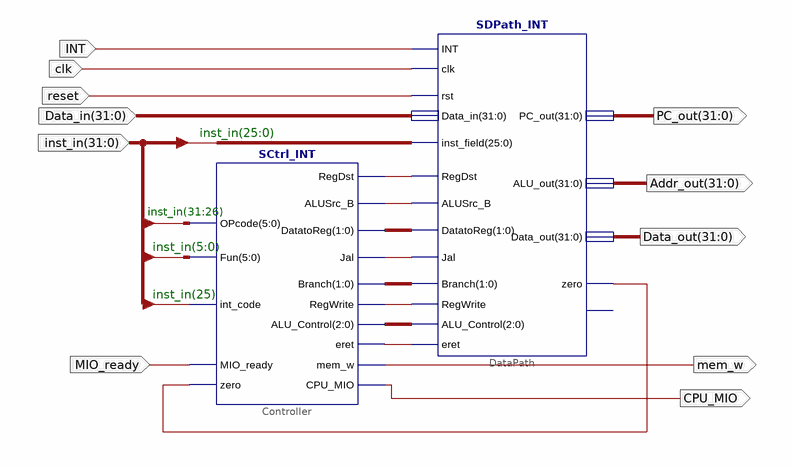
[diagram p0: schematic sheet 1]
// Xilinx ISE schematic SCPU_INT.sch (kintex7) as structural Verilog: 2 symbols, 11 ports
module SCPU_INT (
  input  clk,
  input  [31:0] inst_in,
  input  reset,
  input  [31:0] Data_in,
  input  MIO_ready,
  input  INT,
  output CPU_MIO,
  output mem_w,
  output [31:0] PC_out,
  output [31:0] Addr_out,
  output [31:0] Data_out
);

  wire XLXN_2, XLXN_3, XLXN_5, XLXN_8, XLXN_12, XLXN_17;
  wire [1:0] XLXN_9, XLXN_10;
  wire [2:0] XLXN_16;

  SCtrl_INT Controller (
    .RegDst(XLXN_2), .ALUSrc_B(XLXN_3), .DatatoReg(XLXN_9), .Jal(XLXN_5), .Fun(inst_in[5:0]),
    .OPcode(inst_in[31:26]), .MIO_ready(MIO_ready), .zero(XLXN_12), .CPU_MIO(CPU_MIO), .mem_w(mem_w),
    .Branch(XLXN_10), .RegWrite(XLXN_8), .eret(XLXN_17), .ALU_Control(XLXN_16), .int_code(inst_in[25]));
  SDPath_INT DataPath (
    .RegDst(XLXN_2), .ALUSrc_B(XLXN_3), .DatatoReg(XLXN_9), .Jal(XLXN_5), .Branch(XLXN_10),
    .Data_in(Data_in), .inst_field(inst_in[25:0]), .clk(clk), .rst(reset), .PC_out(PC_out),
    .ALU_out(Addr_out), .Data_out(Data_out), .zero(XLXN_12), .RegWrite(XLXN_8), .ALU_Control(XLXN_16),
    .eret(XLXN_17), .INT(INT));  // open: overflow

  // Notes on the sheet:
  //   inst_in(25:0)
  //   inst_in(31:26)
  //   inst_in(5:0)
  //   inst_in(25)
endmodule
